# EAGLE design transmitter (EAGLE 4.15)
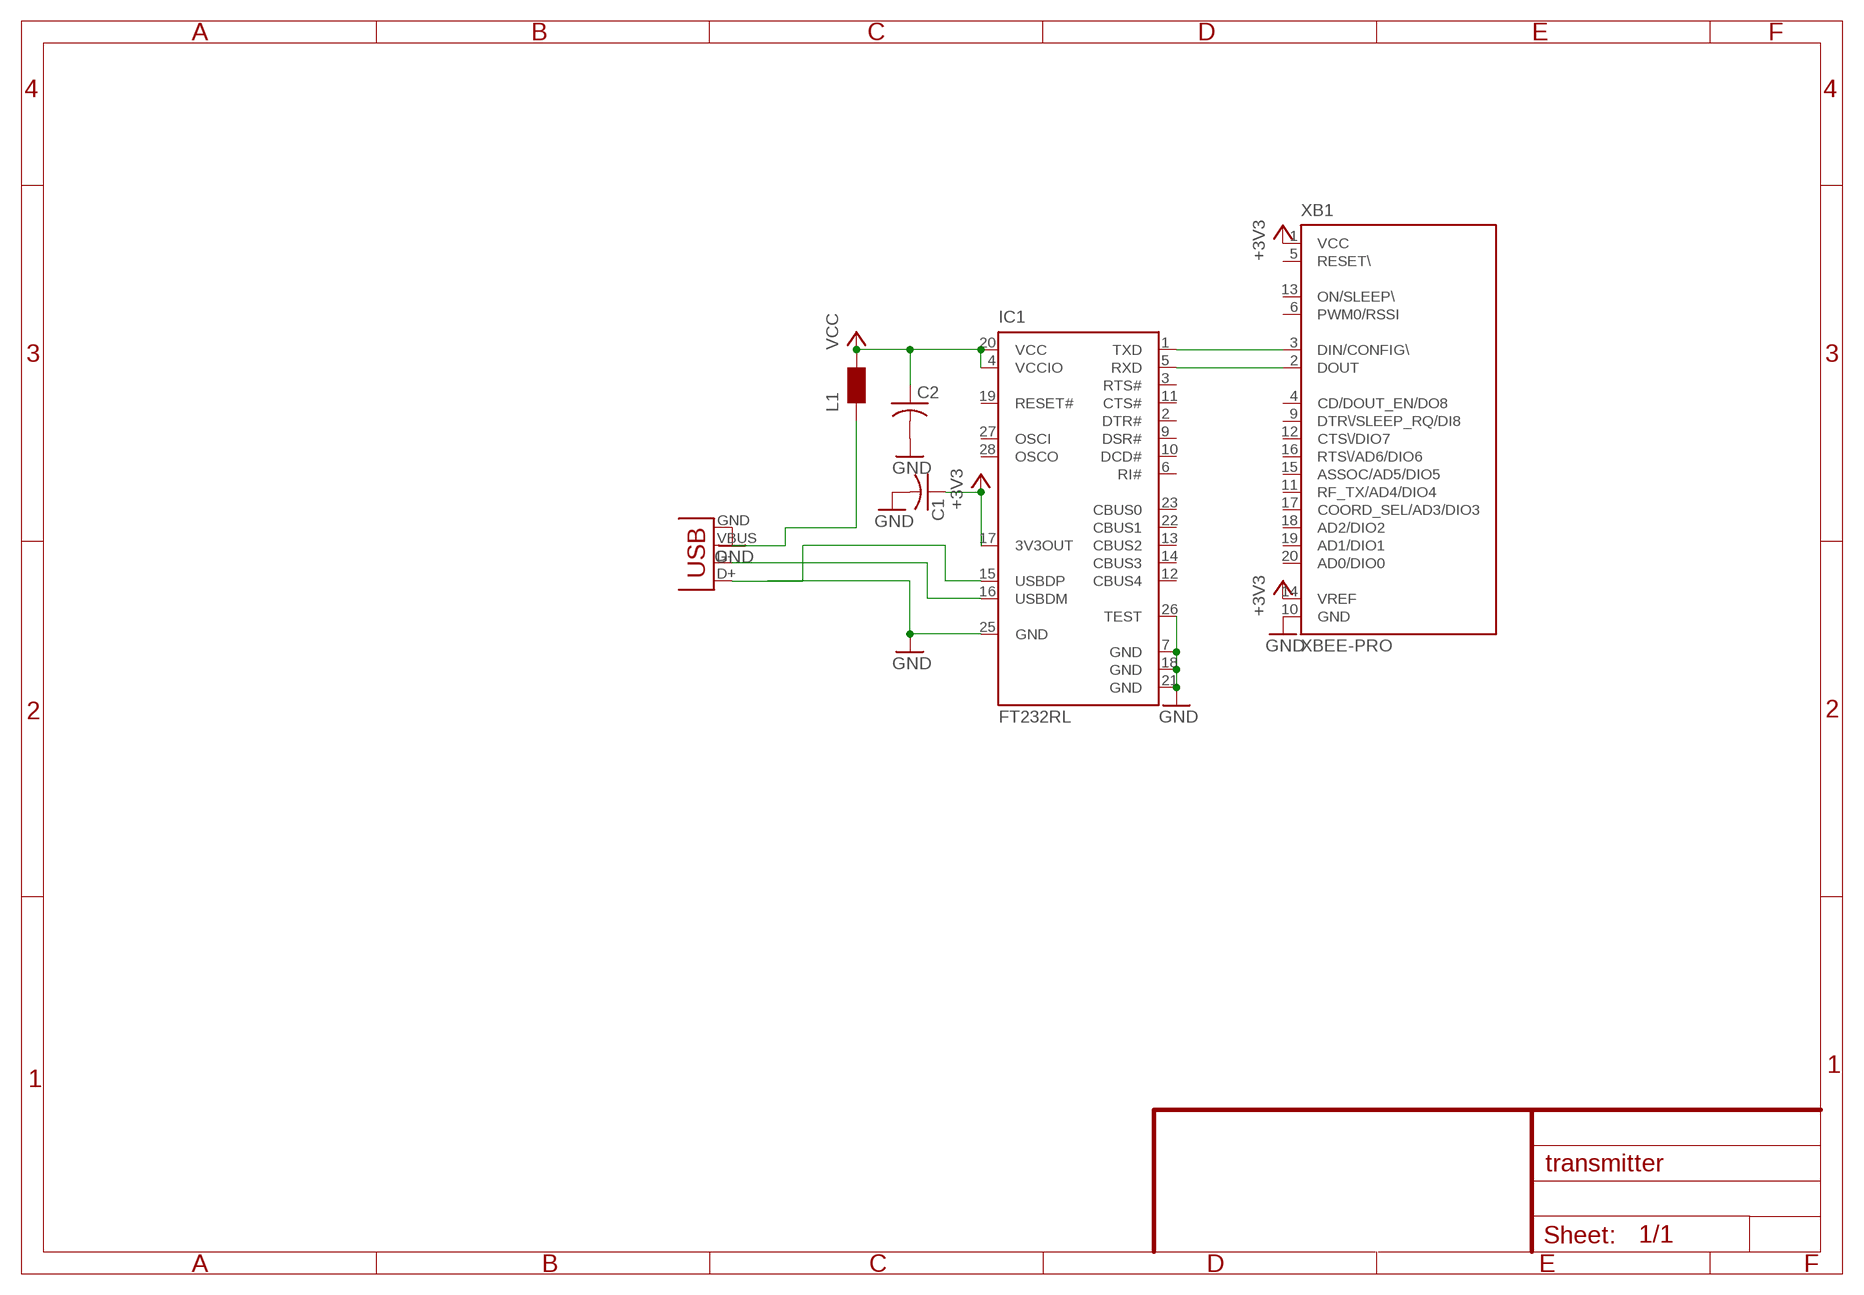
[diagram p0: schematic, sheet 1]

## Parts
C1  C-USC0603  [C0603]
C2  C-USC0603  [C0603]
IC1  FT232RL  [SSOP28]
L1  WE-CBF_0603  [0603]
X1  USBPTH  [USB-B-PTH]
XB1  XBEE-PRO  [XBEE-PRO]

## Nets
+3V3: C1.1 IC1.17(3V3OUT) XB1.1(VCC) XB1.14(VREF)
GND: C1.2 C2.2 IC1.7(GND) IC1.18(GND) IC1.21(GND) IC1.25(GND) IC1.26(TEST) X1.GND XB1.10(GND)
N$2: IC1.15(USBDP) X1.D+
N$3: IC1.16(USBDM) X1.D-
N$6: IC1.1(TXD) XB1.3(DIN/CONFIG\)
N$7: IC1.5(RXD) XB1.2(DOUT)
N$9: L1.1 X1.VBUS
VCC: C2.1 IC1.4(VCCIO) IC1.20(VCC) L1.2
Unconnected: IC1.2(DTR#) IC1.3(RTS#) IC1.6(RI#) IC1.9(DSR#) IC1.10(DCD#) IC1.11(CTS#) IC1.12(CBUS4) IC1.13(CBUS2) IC1.14(CBUS3) IC1.19(RESET#) IC1.22(CBUS1) IC1.23(CBUS0) IC1.27(OSCI) IC1.28(OSCO) XB1.4(CD/DOUT_EN/DO8) XB1.5(RESET\) XB1.6(PWM0/RSSI) XB1.9(DTR\/SLEEP_RQ/DI8) XB1.11(RF_TX/AD4/DIO4) XB1.12(CTS\/DIO7) XB1.13(ON/SLEEP\) XB1.15(ASSOC/AD5/DIO5) XB1.16(RTS\/AD6/DIO6) XB1.17(COORD_SEL/AD3/DIO3) XB1.18(AD2/DIO2) XB1.19(AD1/DIO1) XB1.20(AD0/DIO0)

## Library data of the parts
C1 C2 = rcl:C-US: CAPACITOR, American symbol
IC1 = ftdichip:FT232R: Source: http://www.ftdichip.com/Documents/DataSheets/DS_FT232R_v104.pdf
L1 = wuerth-elektronik:WE-CBF: SMD EMI Suppression Ferrite Beads - excellent anti-EMI properties - low DCR - impedances till 3000 ohms - rated current up to 6 A
X1 = SparkFun:USB: USB Connectors USB-B-PTH is fully proven SKU : PRT-00139 USB-miniB is fully proven SKU : PRT-00587 USB-A-PCB is untested. USB-A-H is throughly reviewed, but untested. Spark Fun Electronics SKU : PRT-00437 USB-B-SMT is throughly reviewed, but untested. Needs silkscreen touching up. USB-A-S has not been used/tested USB-MB-H has not been used/tested
XB1 = maxstream:XBEE: XBee (TM) /XBee-PRO(TM) OEM RF Modules Source: MaxStream, Inc. xbee_productmanual.pdf

## Board
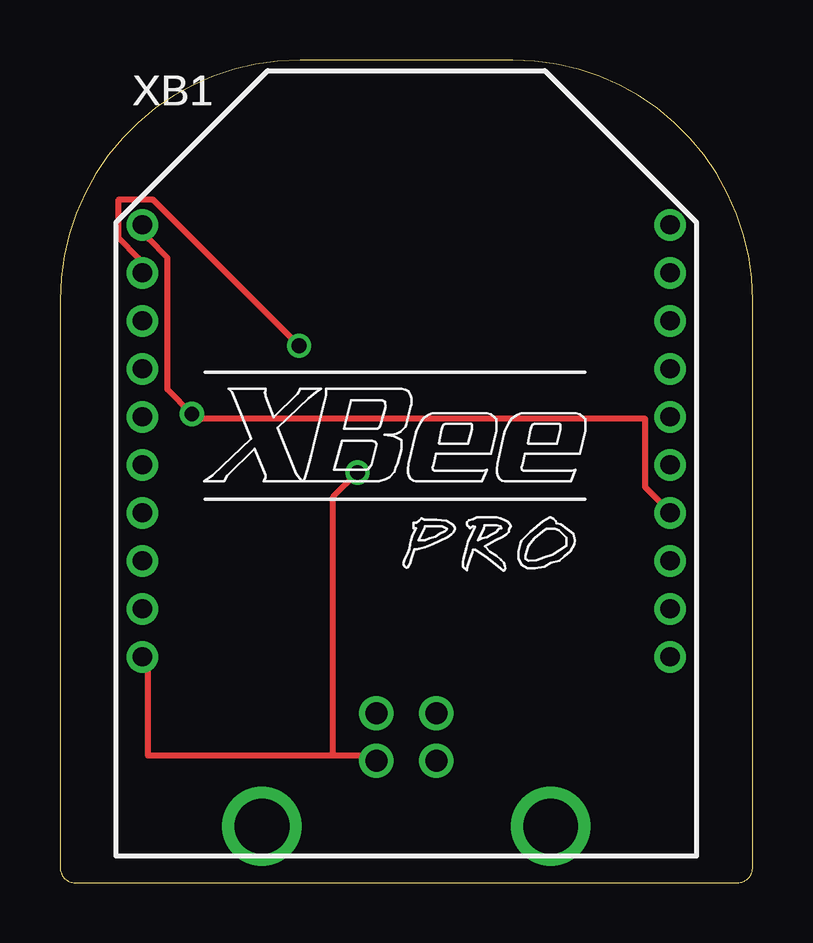
[diagram p1: board, top side]
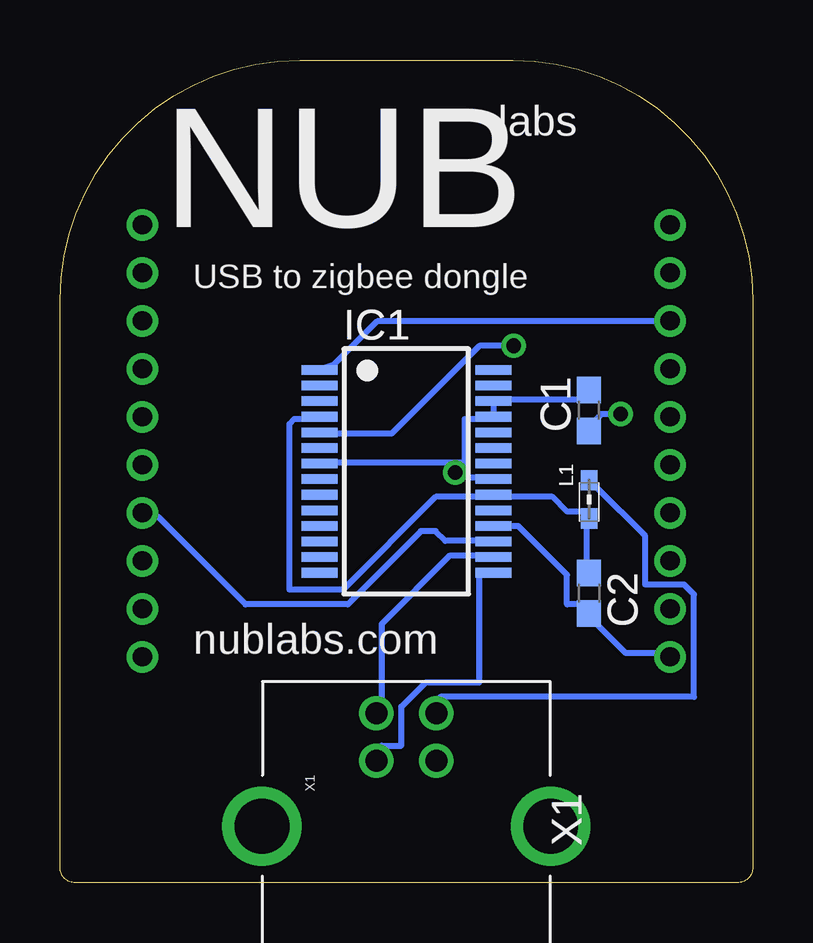
[diagram p2: board, bottom side, seen from below]

Size 28.88 x 34.28 mm. Coordinates in mm from the lower left corner, seen from the top.
Outline: 28.88,24.28 arc90 18.88,34.28 10,34.28 arc90 0,24.28 0,0.63 arc90 0.64,0 28.25,0 arc90 28.88,0.63 28.88,24.28
Copper layers (1*16): Top 0.035mm / dielectric 1.5mm / Bottom 0.035mm
Design rules "default": minimum track width 10mil, minimum drill 24mil, track to track 8mil, track to pad 8mil, pad to pad 8mil, via to via 8mil, smd to smd 8mil, copper to edge 40mil, drill to drill 8mil, minimum pad ring 10mil, minimum via ring 8mil, stop-mask expansion 4mil, vias tented up to drill 0mil, thermal gap 10mil

### Footprints (pad centres in the part's own frame; a part is rotated, then mirrored left to right if it is on the bottom)
C0603 = smd 1.1 x 1: 1 -0.85,0; 2 0.85,0
SSOP28 = smd 0.4 x 1.5: 1 -4.225,-3.625; 2 -3.575,-3.625; 3 -2.925,-3.625; 4 -2.275,-3.625; 5 -1.625,-3.625; 6 -0.975,-3.625; 7 -0.325,-3.625; 8 0.325,-3.625; 9 0.975,-3.625; 10 1.625,-3.625; 11 2.275,-3.625; 12 2.925,-3.625; 13 3.575,-3.625; 14 4.225,-3.625; 15 4.225,3.625; 16 3.575,3.625; 17 2.925,3.625; 18 2.275,3.625; 19 1.625,3.625; 20 0.975,3.625; 21 0.325,3.625; 22 -0.325,3.625; 23 -0.975,3.625; 24 -1.625,3.625; 25 -2.275,3.625; 26 -2.925,3.625; 27 -3.575,3.625; 28 -4.225,3.625
0603 = smd 0.85 x 0.7: 1 -0.9,0; 2 0.7,0
USB-B-PTH = drill 0.914 round: D+ 0,1.25; D- 1.981,1.25; GND 0,-1.25; VBUS 1.981,-1.25 | drill 2.286 round: P$1 -2.718,-6.02; P$2 -2.718,6.02
XBEE-PRO = drill 0.8 pad 1.27 round: 1 -11,9; 2 -11,7; 3 -11,5; 4 -11,3; 5 -11,1; 6 -11,-1; 7 -11,-3; 8 -11,-5; 9 -11,-7; 10 -11,-9; 11 11,-9; 12 11,-7; 13 11,-5; 14 11,-3; 15 11,-1; 16 11,1; 17 11,3; 18 11,5; 19 11,7; 20 11,9

### Placement (x,y rotation side)
C1  6.82,19.68 90 bottom
C2  6.82,12.06 270 bottom
IC1  14.44,17.14 270 bottom
L1  6.82,15.87 270 bottom
X1  14.44,5.08 90 bottom
XB1  14.44,18.41 0 top

### Tracks (layer width: path | path; a pad name or v marks a point on that pad's centre or on a via)
+3V3  (via drill 0.61)
  Top 0.254: XB1.1 3.67,26.84 4.48,26.03 4.48,20.54 v5.5,19.53 5.91,19.32 24.4,19.32 24.4,16.48 25.01,15.87 XB1.14
  Bottom 0.254: v5.5,19.53 6.31,19.53 6.52,19.32 C1.1 | IC1.17 11.39,14.24 12.81,14.24 13.22,14.65 13.83,14.65 16.88,11.6 21.15,11.6 24.8,15.26 XB1.14
GND  (via drill 0.61)
  Top 0.254: 11.39,5.3 3.67,5.3 3.67,8.76 XB1.10 | 11.39,5.3 12.61,5.3 X1.GND | v12.41,17.09 11.39,16.07 11.39,5.3
  Bottom 0.254: C1.2 7.12,20.14 10.17,20.14 IC1.26 10.78,19.93 10.78,19.53 IC1.25 11.39,19.32 12,19.32 12,17.5 | 12,17.09 11.8,16.89 11.39,16.89 IC1.21 | 12,17.09 12,17.5 | 12,17.5 17.49,17.5 IC1.7 | XB1.10 4.08,9.57 5.3,9.57 6.52,10.79 C2.2 7.12,11.6 7.73,11.6 7.73,12.82 9.77,14.85 10.17,14.85 IC1.18 | v12.41,17.09 12,17.09
N$2
  Bottom 0.254: IC1.15 11.39,12.82 11.39,8.35 13.63,8.35 14.64,7.34 14.64,5.71 15.46,5.71 X1.D+
N$3
  Bottom 0.254: IC1.16 11.39,13.63 12.61,13.63 15.46,10.79 15.46,7.74 X1.D-
N$6
  Bottom 0.254: IC1.1 17.49,21.56 15.66,23.39 4.08,23.39 XB1.3
N$7  (via drill 0.61)
  Top 0.254: v9.97,22.37 3.87,28.47 2.45,28.47 2.45,26.84 3.26,26.03 XB1.2
  Bottom 0.254: v9.97,22.37 11.39,22.37 15.05,18.71 17.49,18.71 IC1.5
N$9
  Bottom 0.254: L1.1 6.52,16.48 4.48,14.45 4.48,12.42 2.86,12.42 2.45,12.01 2.45,7.74 13.02,7.74 X1.VBUS
VCC
  Bottom 0.254: C2.1 6.92,13.43 6.92,14.85 L1.2 7.12,15.46 7.73,15.46 8.34,16.07 10.17,16.07 IC1.20 11.39,16.07 13.22,16.07 17.08,12.21 19.32,12.21 19.32,19.12 19.11,19.32 18.71,19.32 IC1.4

### Text on the board
bPlace: labs | NUB | USB to zigbee dongle | nublabs.com
_tNames: XB1 | XB1
_bNames: IC1 | IC1 | C1 | C1 | L1 | L1 | C2 | C2 | X1 | X1